# EAGLE schematic voice-card-controller-1_1-w-thru-hole-xtal (EAGLE 7.2.0)
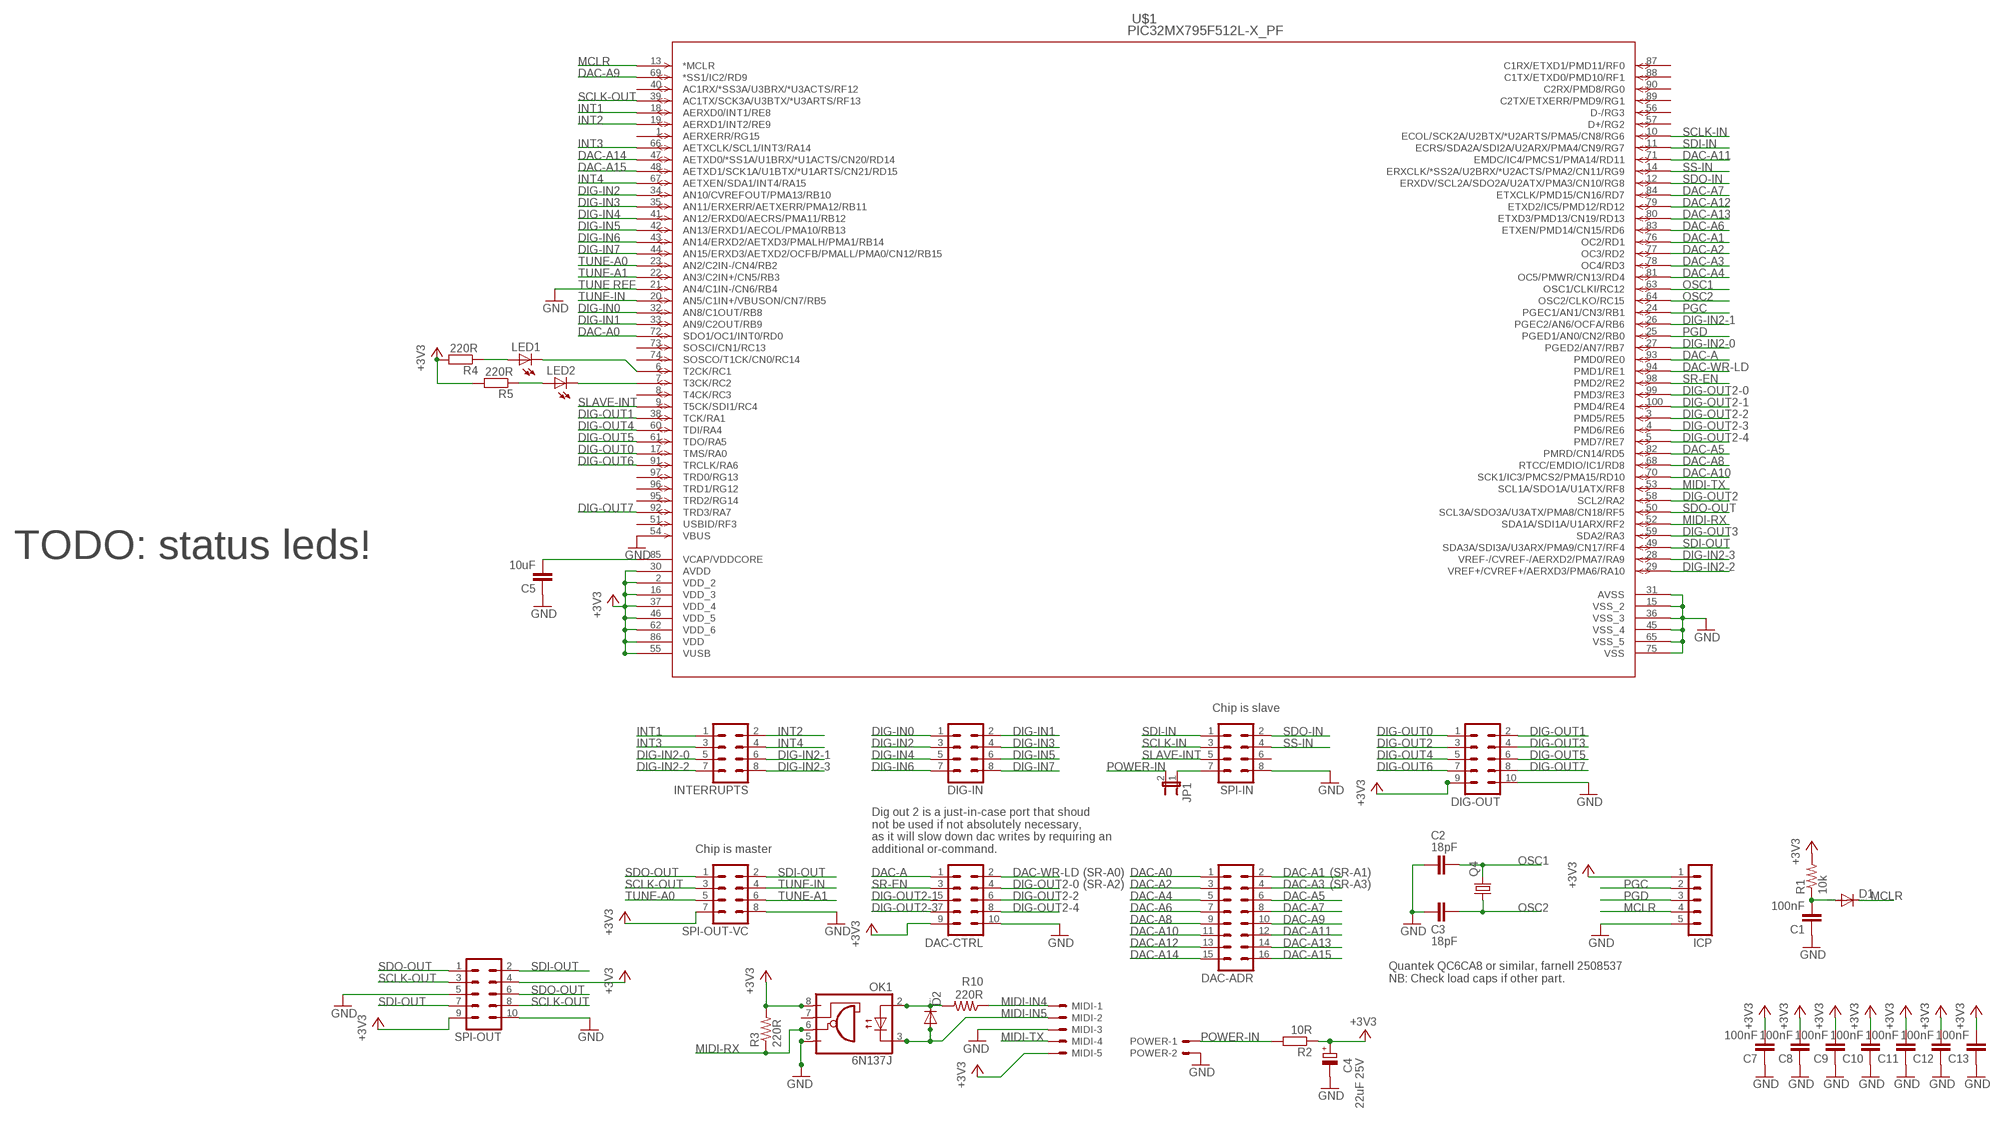
[diagram p0: schematic, sheet 1]

## Parts
C1  100nF  C-EUC0603  [C0603]
C2  18pF  C-EUC0603  [C0603]
C3  18pF  C-EUC0603  [C0603]
C4  22uF 25V  CPOL-EUE2.5-5  [E2,5-5]
C5  10uF  C-EUC0805  [C0805]
C7  100nF  C-EUC0603  [C0603]
C8  100nF  C-EUC0603  [C0603]
C9  100nF  C-EUC0603  [C0603]
C10  100nF  C-EUC0603  [C0603]
C11  100nF  C-EUC0603  [C0603]
C12  100nF  C-EUC0603  [C0603]
C13  100nF  C-EUC0603  [C0603]
D1  DIODE-SOD80C  [SOD80C]
D2  DIODE-SOD80C  [SOD80C]
DAC-ADR  MA08-2J  [MA08-2J]
DAC-CTRL  MA05-2J  [MA05-2J]
DIG-IN  MA04-2J  [MA04-2J]
DIG-OUT  MA05-2J  [MA05-2J]
ICP  MA05-1  [MA05-1]
INTERRUPTS  MA04-2J  [MA04-2J]
JP1  JP1E  [JP1]
LED1  LEDCHIPLED_0603  [CHIPLED_0603]
LED2  LEDCHIPLED_0603  [CHIPLED_0603]
MIDI  22-23-2051  [22-23-2051]
OK1  6N137J  [DIL08-J]
POWER  22-23-2021  [22-23-2021]
Q4  CRYSTALHC49S  [HC49/S]
R1  10k  R-US_R0805  [R0805]
R2  10R  R-EU_0207/7  [0207/7]
R3  220R  R-US_R0805  [R0805]
R4  220R  R-EU_R0603  [R0603]
R5  220R  R-EU_R0603  [R0603]
R10  220R  R-US_R0805  [R0805]
SPI-IN  MA04-2J  [MA04-2J]
SPI-OUT  MA05-2J  [MA05-2J]
SPI-OUT-VC  MA04-2J  [MA04-2J]
U$1  PIC32MX795F512L-X_PF  [TQFP100_14X14MC]

## Nets
+3V3: C4.+ C7.2 C8.2 C9.2 C10.2 C11.2 C12.2 C13.2 DAC-CTRL.9 DIG-OUT.9 ICP.1 MIDI.5 OK1.8(VCC) R1.2 R2.1 R3.2 R4.2 R5.2 SPI-OUT-VC.7 SPI-OUT.4 SPI-OUT.9 U$1.2(VDD_2) U$1.16(VDD_3) U$1.30(AVDD) U$1.37(VDD_4) U$1.46(VDD_5) U$1.55(VUSB) U$1.62(VDD_6) U$1.86(VDD)
DAC-A: DAC-CTRL.1 U$1.93(PMD0/RE0)
DAC-A0: DAC-ADR.1 U$1.72(SDO1/OC1/INT0/RD0)
DAC-A1: DAC-ADR.2 U$1.76(OC2/RD1)
DAC-A2: DAC-ADR.3 U$1.77(OC3/RD2)
DAC-A3: DAC-ADR.4 U$1.78(OC4/RD3)
DAC-A4: DAC-ADR.5 U$1.81(OC5/PMWR/CN13/RD4)
DAC-A5: DAC-ADR.6 U$1.82(PMRD/CN14/RD5)
DAC-A6: DAC-ADR.7 U$1.83(ETXEN/PMD14/CN15/RD6)
DAC-A7: DAC-ADR.8 U$1.84(ETXCLK/PMD15/CN16/RD7)
DAC-A8: DAC-ADR.9 U$1.68(RTCC/EMDIO/IC1/RD8)
DAC-A9: DAC-ADR.10 U$1.69(*SS1/IC2/RD9)
DAC-A10: DAC-ADR.11 U$1.70(SCK1/IC3/PMCS2/PMA15/RD10)
DAC-A11: DAC-ADR.12 U$1.71(EMDC/IC4/PMCS1/PMA14/RD11)
DAC-A12: DAC-ADR.13 U$1.79(ETXD2/IC5/PMD12/RD12)
DAC-A13: DAC-ADR.14 U$1.80(ETXD3/PMD13/CN19/RD13)
DAC-A14: DAC-ADR.15 U$1.47(AETXD0/*SS1A/U1BRX/*U1ACTS/CN20/RD14)
DAC-A15: DAC-ADR.16 U$1.48(AETXD1/SCK1A/U1BTX/*U1ARTS/CN21/RD15)
DAC-WR-LD: DAC-CTRL.2 U$1.94(PMD1/RE1)
DIG-IN0: DIG-IN.1 U$1.32(AN8/C1OUT/RB8)
DIG-IN1: DIG-IN.2 U$1.33(AN9/C2OUT/RB9)
DIG-IN2: DIG-IN.3 U$1.34(AN10/CVREFOUT/PMA13/RB10)
DIG-IN2-0: INTERRUPTS.5 U$1.27(PGED2/AN7/RB7)
DIG-IN2-1: INTERRUPTS.6 U$1.26(PGEC2/AN6/OCFA/RB6)
DIG-IN2-2: INTERRUPTS.7 U$1.29(VREF+/CVREF+/AERXD3/PMA6/RA10)
DIG-IN2-3: INTERRUPTS.8 U$1.28(VREF-/CVREF-/AERXD2/PMA7/RA9)
DIG-IN3: DIG-IN.4 U$1.35(AN11/ERXERR/AETXERR/PMA12/RB11)
DIG-IN4: DIG-IN.5 U$1.41(AN12/ERXD0/AECRS/PMA11/RB12)
DIG-IN5: DIG-IN.6 U$1.42(AN13/ERXD1/AECOL/PMA10/RB13)
DIG-IN6: DIG-IN.7 U$1.43(AN14/ERXD2/AETXD3/PMALH/PMA1/RB14)
DIG-IN7: DIG-IN.8 U$1.44(AN15/ERXD3/AETXD2/OCFB/PMALL/PMA0/CN12/RB15)
DIG-OUT0: DIG-OUT.1 U$1.17(TMS/RA0)
DIG-OUT1: DIG-OUT.2 U$1.38(TCK/RA1)
DIG-OUT2: DIG-OUT.3 U$1.58(SCL2/RA2)
DIG-OUT2-0: DAC-CTRL.4 U$1.99(PMD3/RE3)
DIG-OUT2-1: DAC-CTRL.5 U$1.100(PMD4/RE4)
DIG-OUT2-2: DAC-CTRL.6 U$1.3(PMD5/RE5)
DIG-OUT2-3: DAC-CTRL.7 U$1.4(PMD6/RE6)
DIG-OUT2-4: DAC-CTRL.8 U$1.5(PMD7/RE7)
DIG-OUT3: DIG-OUT.4 U$1.59(SDA2/RA3)
DIG-OUT4: DIG-OUT.5 U$1.60(TDI/RA4)
DIG-OUT5: DIG-OUT.6 U$1.61(TDO/RA5)
DIG-OUT6: DIG-OUT.7 U$1.91(TRCLK/RA6)
DIG-OUT7: DIG-OUT.8 U$1.92(TRD3/RA7)
GND: C1.1 C2.2 C3.2 C4.- C5.1 C7.1 C8.1 C9.1 C10.1 C11.1 C12.1 C13.1 DAC-CTRL.10 DIG-OUT.10 ICP.5 MIDI.3 OK1.5(GND) POWER.2 SPI-IN.8 SPI-OUT-VC.8 SPI-OUT.5 SPI-OUT.10 U$1.15(VSS_2) U$1.21(AN4/C1IN-/CN6/RB4) U$1.31(AVSS) U$1.36(VSS_3) U$1.45(VSS_4) U$1.54(VBUS) U$1.65(VSS_5) U$1.75(VSS)
INT1: INTERRUPTS.1 U$1.18(AERXD0/INT1/RE8)
INT2: INTERRUPTS.2 U$1.19(AERXD1/INT2/RE9)
INT3: INTERRUPTS.3 U$1.66(AETXCLK/SCL1/INT3/RA14)
INT4: INTERRUPTS.4 U$1.67(AETXEN/SDA1/INT4/RA15)
MCLR: D1.C ICP.4 U$1.13(*MCLR)
MIDI-IN4: MIDI.1 R10.1
MIDI-IN5: D2.A MIDI.2 OK1.3(C)
MIDI-RX: OK1.6(VO) R3.1 U$1.52(SDA1A/SDI1A/U1ARX/RF2)
MIDI-TX: MIDI.4 U$1.53(SCL1A/SDO1A/U1ATX/RF8)
N$1: C5.2 U$1.85(VCAP/VDDCORE)
N$2: JP1.1 SPI-IN.7
N$3: LED1.A R4.1
N$4: C1.2 D1.A R1.1
N$5: D2.C OK1.2(A) R10.2
N$6: LED1.C U$1.6(T2CK/RC1)
N$7: LED2.C U$1.7(T3CK/RC2)
N$8: LED2.A R5.1
OSC1: C2.1 Q4.2 U$1.63(OSC1/CLKI/RC12)
OSC2: C3.1 Q4.1 U$1.64(OSC2/CLKO/RC15)
PGC: ICP.2 U$1.24(PGEC1/AN1/CN3/RB1)
PGD: ICP.3 U$1.25(PGED1/AN0/CN2/RB0)
POWER-IN: JP1.2 POWER.1 R2.2
SCLK-IN: SPI-IN.3 U$1.10(ECOL/SCK2A/U2BTX/*U2ARTS/PMA5/CN8/RG6)
SCLK-OUT: SPI-OUT-VC.3 SPI-OUT.3 SPI-OUT.8 U$1.39(AC1TX/SCK3A/U3BTX/*U3ARTS/RF13)
SDI-IN: SPI-IN.1 U$1.11(ECRS/SDA2A/SDI2A/U2ARX/PMA4/CN9/RG7)
SDI-OUT: SPI-OUT-VC.2 SPI-OUT.2 SPI-OUT.7 U$1.49(SDA3A/SDI3A/U3ARX/PMA9/CN17/RF4)
SDO-IN: SPI-IN.2 U$1.12(ERXDV/SCL2A/SDO2A/U2ATX/PMA3/CN10/RG8)
SDO-OUT: SPI-OUT-VC.1 SPI-OUT.1 SPI-OUT.6 U$1.50(SCL3A/SDO3A/U3ATX/PMA8/CN18/RF5)
SLAVE-INT: SPI-IN.5 U$1.9(T5CK/SDI1/RC4)
SR-EN: DAC-CTRL.3 U$1.98(PMD2/RE2)
SS-IN: SPI-IN.4 U$1.14(ERXCLK/*SS2A/U2BRX/*U2ACTS/PMA2/CN11/RG9)
TUNE-A0: SPI-OUT-VC.5 U$1.23(AN2/C2IN-/CN4/RB2)
TUNE-A1: SPI-OUT-VC.6 U$1.22(AN3/C2IN+/CN5/RB3)
TUNE-IN: SPI-OUT-VC.4 U$1.20(AN5/C1IN+/VBUSON/CN7/RB5)
Unconnected: OK1.7(VE) SPI-IN.6 U$1.1(AERXERR/RG15) U$1.8(T4CK/RC3) U$1.40(AC1RX/*SS3A/U3BRX/*U3ACTS/RF12) U$1.51(USBID/RF3) U$1.56(D-/RG3) U$1.57(D+/RG2) U$1.73(SOSCI/CN1/RC13) U$1.74(SOSCO/T1CK/CN0/RC14) U$1.87(C1RX/ETXD1/PMD11/RF0) U$1.88(C1TX/ETXD0/PMD10/RF1) U$1.89(C2TX/ETXERR/PMD9/RG1) U$1.90(C2RX/PMD8/RG0) U$1.95(TRD2/RG14) U$1.96(TRD1/RG12) U$1.97(TRD0/RG13)

## Notes on the sheet
- TUNE REF
- TODO: status leds!
- Chip is slave
- Chip is master
- Dig out 2 is a just-in-case port that shoud
  not be used if not absolutely necessary,
  as it will slow down dac writes by requiring an 
  additional or-command.
- (SR-A0) | (SR-A1)
- (SR-A2) | (SR-A3)
- Quantek QC6CA8 or similar, farnell 2508537
  NB: Check load caps if other part.

## Library data of the parts
C1-C3 C5 C7-C13 = resistor:C-EU: CAPACITOR, European symbol
C4 = resistor:CPOL-EU: POLARIZED CAPACITOR, European symbol
D1 D2 = diode:DIODE-: DIODE
DAC-ADR = joakim:MA08-2J: PIN HEADER; OC_FARNELL: unknown; OC_NEWARK: unknown
DAC-CTRL DIG-OUT SPI-OUT = joakim:MA05-2J: PIN HEADER; OC_FARNELL: unknown; OC_NEWARK: unknown
DIG-IN INTERRUPTS SPI-IN SPI-OUT-VC = joakim:MA04-2J: PIN HEADER; OC_FARNELL: unknown; OC_NEWARK: unknown
ICP = joakim:MA05-1: PIN HEADER; OC_FARNELL: unknown; OC_NEWARK: unknown
JP1 = jumper:JP1E: JUMPER
LED1 LED2 = led:LED: LED OSRAM: - CHIPLED LG R971, LG N971, LY N971, LG Q971, LY Q971, LO R971, LY R971 LH N974, LH R974 LS Q976, LO Q976, LY Q976 LO Q996 - Hyper CHIPLED LW Q18S LB Q993, LB Q99A, LB R99A - SideLED LS A670, LO A670, LY A670, LG A670, LP A670 LB A673, LV A673, LT A673, LW A673 LH A674 LY A675 LS A676, LA A676, LO A676, LY A676, LW A676 LS A679, LY A679, LG A679 - Hyper Micro SIDELED® LS Y876, LA Y876, LO Y876, LY Y876 LT Y87S - SmartLED LW L88C, LW L88S LB L89C, LB L89S, LG L890 LS L89K, LO L89K, LY L89K LS L896, LA L896, LO L896, LY L896 - TOPLED LS T670, LO T670, LY T670, LG T670, LP T670 LSG T670, LSP T670, LSY T670, LOP T670, LYG T670 LG T671, LOG T671, LSG T671 LB T673, LV T673, LT T673, LW T673 LH T674 LS T676, LA T676, LO T676, LY T676, LB T676, LH T676, LSB T676, LW T676 LB T67C, LV T67C, LT T67C, LS T67K, LO T67K, LY T67K, LW E67C LS E67B, LA E67B, LO E67B, LY E67B, LB E67C, LV E67C, LT E67C LW T67C LS T679, LY T679, LG T679 LS T770, LO T770, LY T770, LG T770, LP T770 LB T773, LV T773, LT T773, LW T773 LH T774 LS E675, LA E675, LY E675, LS T675 LS T776, LA T776, LO T776, LY T776, LB T776 LHGB T686 LT T68C, LB T68C - Hyper Mini TOPLED® LB M676 - Mini TOPLED Santana® LG M470 LS M47K, LO M47K, LY M47K Source: http://www.osram.convergy.de LUXEON: - LUMILED® LXK2-PW12-R00, LXK2-PW12-S00, LXK2-PW14-U00, LXK2-PW14-V00 LXK2-PM12-R00, LXK2-PM12-S00, LXK2-PM14-U00 LXK2-PE12-Q00, LXK2-PE12-R00, LXK2-PE12-S00, LXK2-PE14-T00, LXK2-PE14-U00 LXK2-PB12-K00, LXK2-PB12-L00, LXK2-PB12-M00, LXK2-PB14-N00, LXK2-PB14-P00, LXK2-PB14-Q00 LXK2-PR12-L00, LXK2-PR12-M00, LXK2-PR14-Q00, LXK2-PR14-R00 LXK2-PD12-Q00, LXK2-PD12-R00, LXK2-PD12-S00 LXK2-PH12-R00, LXK2-PH12-S00 LXK2-PL12-P00, LXK2-PL12-Q00, LXK2-PL12-R00 Source: www.luxeon.com KINGBRIGHT: KA-3528ASYC Source: www.kingbright.com
MIDI = con-molex:22-23-2051: .100" (2.54mm) Center Header - 5 Pin; MF: MOLEX; MPN: 22-23-2051; OC_FARNELL: 1462952; OC_NEWARK: 38C9178
OK1 = joakim:6N137: MOTOROLA OPTO COUPLER
POWER = con-molex:22-23-2021: .100" (2.54mm) Center Header - 2 Pin; MF: MOLEX; MPN: 22-23-2021; OC_FARNELL: 1462926; OC_NEWARK: 25C3832
Q4 = crystal:CRYSTAL: CRYSTAL; OC_FARNELL: 1667008; OC_NEWARK: unknown
R1 R3 R10 = resistor:R-US_: RESISTOR, American symbol
R2 R4 R5 = resistor:R-EU_: RESISTOR, European symbol
U$1 = pic32mx-795F-512L:PIC32MX795F512L-X_PF